# EAGLE schematic Beta24_mix (EAGLE 9.4.2)

## Sheet 1 of 2
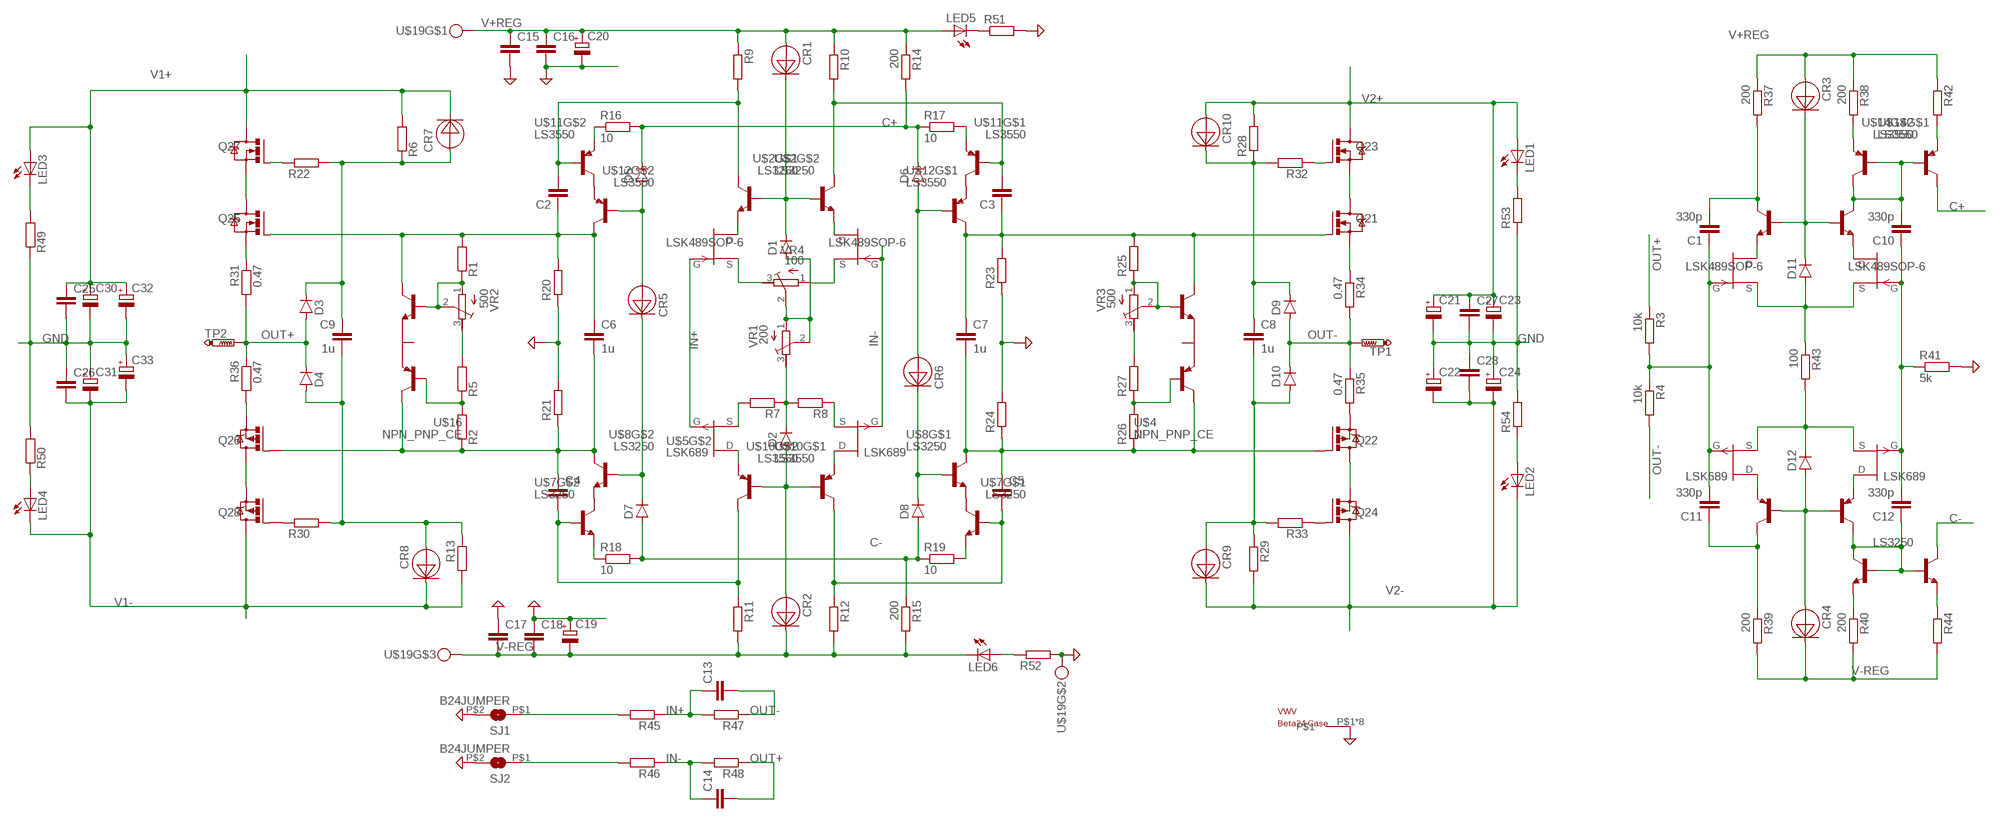
[diagram p0: schematic, sheet 1]

### Parts
C1  330p  C-EUC1206  [C1206]
C2  C-EUC1206  [C1206]
C3  C-EUC1206  [C1206]
C4  C-EUC1206  [C1206]
C5  C-EUC1206  [C1206]
C6  1u  C-EUC1210  [C1210]
C7  1u  C-EUC1210  [C1210]
C8  1u  C-EUC1206  [C1206]
C9  1u  C-EUC1206  [C1206]
C10  330p  C-EUC1206  [C1206]
C11  330p  C-EUC1206  [C1206]
C12  330p  C-EUC1206  [C1206]
C13  C-EUC1206  [C1206]
C14  C-EUC1206  [C1206]
C15  C-EUC1206  [C1206]
C16  C-EUC1206  [C1206]
C17  C-EUC1206  [C1206]
C18  C-EUC1206  [C1206]
C19  CPOL-EUG  [PANASONIC_G]
C20  CPOL-EUG  [PANASONIC_G]
C21  CPOL-EUG  [PANASONIC_G]
C22  CPOL-EUG  [PANASONIC_G]
C23  CPOL-EUG  [PANASONIC_G]
C24  CPOL-EUG  [PANASONIC_G]
C25  C-EUC1206  [C1206]
C26  C-EUC1206  [C1206]
C27  C-EUC1206  [C1206]
C28  C-EUC1206  [C1206]
C30  CPOL-EUG  [PANASONIC_G]
C31  CPOL-EUG  [PANASONIC_G]
C32  CPOL-EUG  [PANASONIC_G]
C33  CPOL-EUG  [PANASONIC_G]
CR1  1N5283  [SMD]
CR2  1N5283  [SMD]
CR3  1N5283  [SMD]
CR4  1N5283  [SMD]
CR5  1N5283  [SMD]
CR6  1N5283  [SMD]
CR7  1N5283  [SMD]
CR8  1N5283  [SMD]
CR9  1N5283  [SMD]
CR10  1N5283  [SMD]
D1  DIODE-SOD80C  [SOD80C]
D2  DIODE-SOD80C  [SOD80C]
D3  DIODE-SOD80C  [SOD80C]
D4  DIODE-SOD80C  [SOD80C]
D5  DIODE-SOD80C  [SOD80C]
D6  DIODE-SOD80C  [SOD80C]
D7  DIODE-SOD80C  [SOD80C]
D8  DIODE-SOD80C  [SOD80C]
D9  DIODE-SOD80C  [SOD80C]
D10  DIODE-SOD80C  [SOD80C]
D11  DIODE-SOD80C  [SOD80C]
D12  DIODE-SOD80C  [SOD80C]
LED1  LED_LEDSML1206  [LED_SML1206]
LED2  LED_LEDSML1206  [LED_SML1206]
LED3  LED_LEDSML1206  [LED_SML1206]
LED4  LED_LEDSML1206  [LED_SML1206]
LED5  LED_LEDSML1206  [LED_SML1206]
LED6  LED_LEDSML1206  [LED_SML1206]
Q21  IRFZ24ND2PAK  [TO254P1054X240-3M]
Q22  IRF9Z34D2PAK  [TO254P1054X240-3M]
Q23  IRFZ24ND2PAK  [TO254P1054X240-3M]
Q24  IRF9Z34D2PAK  [TO254P1054X240-3M]
Q25  IRFZ24ND2PAK  [TO254P1054X240-3M]
Q26  IRF9Z34D2PAK  [TO254P1054X240-3M]
Q27  IRFZ24ND2PAK  [TO254P1054X240-3M]
Q28  IRF9Z34D2PAK  [TO254P1054X240-3M]
R1  R-EU_MELF0204W  [MINI_MELF-0204W]
R2  R-EU_MELF0204W  [MINI_MELF-0204W]
R3  10k  R-EU_MELF0204W  [MINI_MELF-0204W]
R4  10k  R-EU_MELF0204W  [MINI_MELF-0204W]
R5  R-EU_MELF0204W  [MINI_MELF-0204W]
R6  R-EU_MELF0204W  [MINI_MELF-0204W]
R7  R-EU_MELF0204W  [MINI_MELF-0204W]
R8  R-EU_MELF0204W  [MINI_MELF-0204W]
R9  R-EU_MELF0204W  [MINI_MELF-0204W]
R10  R-EU_MELF0204W  [MINI_MELF-0204W]
R11  R-EU_MELF0204W  [MINI_MELF-0204W]
R12  R-EU_MELF0204W  [MINI_MELF-0204W]
R13  R-EU_MELF0204W  [MINI_MELF-0204W]
R14  200  R-EU_MELF0204W  [MINI_MELF-0204W]
R15  200  R-EU_MELF0204W  [MINI_MELF-0204W]
R16  10  R-EU_MELF0204W  [MINI_MELF-0204W]
R17  10  R-EU_MELF0204W  [MINI_MELF-0204W]
R18  10  R-EU_MELF0204W  [MINI_MELF-0204W]
R19  10  R-EU_MELF0204W  [MINI_MELF-0204W]
R20  R-EU_MELF0204W  [MINI_MELF-0204W]
R21  R-EU_MELF0204W  [MINI_MELF-0204W]
R22  R-EU_MELF0204W  [MINI_MELF-0204W]
R23  R-EU_MELF0204W  [MINI_MELF-0204W]
R24  R-EU_MELF0204W  [MINI_MELF-0204W]
R25  R-EU_MELF0204W  [MINI_MELF-0204W]
R26  R-EU_MELF0204W  [MINI_MELF-0204W]
R27  R-EU_MELF0204W  [MINI_MELF-0204W]
R28  R-EU_MELF0204W  [MINI_MELF-0204W]
R29  R-EU_MELF0204W  [MINI_MELF-0204W]
R30  R-EU_MELF0204W  [MINI_MELF-0204W]
R31  0.47  R-EU_R2512  [R2512]
R32  R-EU_MELF0204W  [MINI_MELF-0204W]
R33  R-EU_MELF0204W  [MINI_MELF-0204W]
R34  0.47  R-EU_R2512  [R2512]
R35  0.47  R-EU_R2512  [R2512]
R36  0.47  R-EU_R2512  [R2512]
R37  200  R-EU_MELF0204W  [MINI_MELF-0204W]
R38  200  R-EU_MELF0204W  [MINI_MELF-0204W]
R39  200  R-EU_MELF0204W  [MINI_MELF-0204W]
R40  200  R-EU_MELF0204W  [MINI_MELF-0204W]
R41  5k  R-EU_MELF0204W  [MINI_MELF-0204W]
R42  R-EU_MELF0204W  [MINI_MELF-0204W]
R43  100  R-EU_MELF0204W  [MINI_MELF-0204W]
R44  R-EU_MELF0204W  [MINI_MELF-0204W]
R45  R-EU_MELF0204W  [MINI_MELF-0204W]
R46  R-EU_MELF0204W  [MINI_MELF-0204W]
R47  R-EU_MELF0204W  [MINI_MELF-0204W]
R48  R-EU_MELF0204W  [MINI_MELF-0204W]
R49  R-EU_MELF0204W  [MINI_MELF-0204W]
R50  R-EU_MELF0204W  [MINI_MELF-0204W]
R51  200  R-EU_MELF0204W  [MINI_MELF-0204W]
R52  R-EU_MELF0204W  [MINI_MELF-0204W]
R53  R-EU_MELF0204W  [MINI_MELF-0204W]
R54  R-EU_MELF0204W  [MINI_MELF-0204W]
SJ1  B24JUMPER  [B24J]
SJ2  B24JUMPER  [B24J]
TP1  PTR1PAD1-20  [P1-20]
TP2  PTR1PAD1-20  [P1-20]
U$1  LSK489SOP-6  [SOT-23-6]
U$2  LS3250  [SOT-23-6]
U$3  LSK489SOP-6  [SOT-23-6]
U$4  NPN_PNP_CE  [SOT25]
U$5  LSK689  [SOT-23-6]
U$6  LS3250  [SOT-23-6]
U$7  LS3250  [SOT-23-6]
U$8  LS3250  [SOT-23-6]
U$9  LS3550  [SOT-23-6]
U$10  LS3550  [SOT-23-6]
U$11  LS3550  [SOT-23-6]
U$12  LS3550  [SOT-23-6]
U$13  LS3250  [SOT-23-6]
U$14  LS3550  [SOT-23-6]
U$15  LSK689  [SOT-23-6]
U$16  NPN_PNP_CE  [SOT25]
U$17  VWV  [VWV]
U$18  B24C  [B24C]
U$19  CON-PTSM-3  [CON-PTSM-3]
VR1  200  R-TRIMM3296W  [RTRIM3296W]
VR2  500  R-TRIMM3296W  [RTRIM3296W]
VR3  500  R-TRIMM3296W  [RTRIM3296W]
VR4  100  R-TRIMM3296W  [RTRIM3296W]

### Nets
C+: D5.C D6.C R14.2 R16.2 R17.1 U$14.6(C)
C-: D7.A D8.A R15.1 R18.2 R19.1 U$13.6(C)
GND: C15.2 C16.2 C17.1 C18.1 C19.+ C20.- C21.- C22.+ C23.- C24.+ C25.2 C26.1 C27.2 C28.1 C30.- C31.+ C32.- C33.+ R20.1 R21.2 R23.1 R24.2 R41.2 R49.1 R50.2 R51.2 R52.2 R53.1 R54.2 SJ1.P$2 SJ2.P$2 U$18.P$1 U$18.P$2 U$18.P$3 U$18.P$4 U$18.P$5 U$18.P$6 U$18.P$7 U$18.P$8 U$19.P$4 ; also sheet 2
IN+: C13.1 R45.1 R47.2 U$1.1(G) U$5.4(G)
IN-: C14.1 R46.1 R48.2 U$1.4(G) U$5.1(G)
N$1: C12.1 U$9.6(C) U$13.1(B) U$13.3(B) U$13.4(C)
N$2: U$1.5(D) U$2.2(E)
N$3: U$1.3(S) VR4.3(E)
N$4: R7.2 U$5.6(S)
N$5: U$1.2(D) U$2.5(E)
N$6: U$5.5(D) U$10.2(E)
N$7: U$1.6(S) VR4.1(A)
N$8: D2.C R7.1 R8.2 VR1.3(E)
N$9: R8.1 U$5.3(S)
N$10: U$5.2(D) U$10.5(E)
N$11: D1.A VR1.1(A) VR1.2(S) VR4.2(S)
N$12: CR2.ANODE D2.A U$10.1(B) U$10.3(B)
N$13: C2.2 R9.2 U$2.6(C) U$11.3(B)
N$14: C3.2 R10.2 U$2.4(C) U$11.1(B)
N$15: C3.1 C7.1 Q21.1(G) R23.2 R25.2 U$4.5(C1) U$12.6(C)
N$16: CR1.CATHODE D1.C U$2.1(B) U$2.3(B)
N$17: R40.1 U$13.2(E)
N$18: C5.2 R12.1 U$7.1(B) U$10.6(C)
N$19: C1.1 C11.2 R3.2 R4.1 U$3.1(G) U$15.4(G)
N$20: C8.2 CR9.ANODE D10.A R29.1 R33.2
N$21: D12.C R43.2 U$15.3(S) U$15.6(S)
N$22: D11.A R43.1 U$3.3(S) U$3.6(S)
N$23: U$11.6(C) U$12.5(E)
N$24: C4.2 R11.1 U$7.3(B) U$10.4(C)
N$25: U$11.4(C) U$12.2(E)
N$26: R38.2 U$14.2(E)
N$27: R16.1 U$11.2(E)
N$28: R17.2 U$11.5(E)
N$29: C10.2 U$6.4(C) U$14.1(B) U$14.3(B) U$14.4(C)
N$30: R18.1 U$7.2(E)
N$31: R19.2 U$7.5(E)
N$32: R45.2 SJ1.P$1
N$33: U$3.5(D) U$6.2(E)
N$34: CR4.ANODE D12.A U$9.1(B) U$9.3(B)
N$35: C2.1 C6.1 Q25.1(G) R1.2 R20.2 U$12.4(C) U$16.5(C1)
N$36: C4.1 C6.2 Q26.1(G) R2.1 R21.1 U$8.4(C) U$16.4(C2)
N$37: U$7.6(C) U$8.5(E)
N$38: U$7.4(C) U$8.2(E)
N$39: R25.1 U$4.1(B1) VR3.1(A) VR3.2(S)
N$42: C1.2 R37.2 U$6.6(C)
N$43: CR5.ANODE D5.A U$12.3(B)
N$44: CR6.ANODE D6.A U$12.1(B)
N$45: CR5.CATHODE D7.C U$8.3(B)
N$46: CR6.CATHODE D8.C U$8.1(B)
N$47: R26.2 R27.1 U$4.3(B2)
N$48: R27.2 VR3.3(E)
N$50: C5.1 C7.2 Q22.1(G) R24.1 R26.1 U$4.4(C2) U$8.6(C)
N$51: R2.2 R5.1 U$16.3(B2)
N$53: R44.1 U$13.5(E)
N$54: C8.1 CR10.CATHODE D9.C R28.1 R32.2
N$57: Q21.2(D) Q21.4(D) Q21.P$1(D) Q21.P$2(D) Q21.P$3(D) Q21.P$4(D) Q21.P$5(D) Q21.P$6(D) Q21.P$7(D) Q21.P$8(D) Q21.P$9(D) Q21.P$10(D) Q21.P$11(D) Q21.P$12(D) Q21.P$13(D) Q21.P$14(D) Q21.P$15(D) Q21.P$16(D) Q21.P$17(D) Q21.P$18(D) Q21.P$19(D) Q21.P$20(D) Q21.P$21(D) Q21.P$22(D) Q21.P$23(D) Q21.P$24(D) Q21.P$25(D) Q21.P$26(D) Q21.P$27(D) Q21.P$28(D) Q21.P$29(D) Q21.P$30(D) Q21.P$31(D) Q21.P$32(D) Q21.P$33(D) Q21.P$34(D) Q21.P$35(D) Q21.P$36(D) Q21.P$37(D) Q21.P$38(D) Q21.P$39(D) Q21.P$40(D) Q21.P$41(D) Q21.P$42(D) Q21.P$43(D) Q21.P$44(D) Q21.P$45(D) Q21.P$46(D) Q21.P$47(D) Q21.P$48(D) Q21.P$49(D) Q21.P$50(D) Q21.P$51(D) Q21.P$52(D) Q21.P$53(D) Q21.P$54(D) Q21.P$55(D) Q21.P$56(D) Q21.P$57(D) Q21.P$58(D) Q21.P$59(D) Q21.P$60(D) Q21.P$61(D) Q21.P$62(D) Q21.P$63(D) Q23.3(S)
N$58: Q22.2(D) Q22.4(D) Q22.P$1(D) Q22.P$2(D) Q22.P$3(D) Q22.P$4(D) Q22.P$5(D) Q22.P$6(D) Q22.P$7(D) Q22.P$8(D) Q22.P$9(D) Q22.P$10(D) Q22.P$11(D) Q22.P$12(D) Q22.P$13(D) Q22.P$14(D) Q22.P$15(D) Q22.P$16(D) Q22.P$17(D) Q22.P$18(D) Q22.P$19(D) Q22.P$20(D) Q22.P$21(D) Q22.P$22(D) Q22.P$23(D) Q22.P$24(D) Q22.P$25(D) Q22.P$26(D) Q22.P$27(D) Q22.P$28(D) Q22.P$29(D) Q22.P$30(D) Q22.P$31(D) Q22.P$32(D) Q22.P$33(D) Q22.P$34(D) Q22.P$35(D) Q22.P$36(D) Q22.P$37(D) Q22.P$38(D) Q22.P$39(D) Q22.P$40(D) Q22.P$41(D) Q22.P$42(D) Q22.P$43(D) Q22.P$44(D) Q22.P$45(D) Q22.P$46(D) Q22.P$47(D) Q22.P$48(D) Q22.P$49(D) Q22.P$50(D) Q22.P$51(D) Q22.P$52(D) Q22.P$53(D) Q22.P$54(D) Q22.P$55(D) Q22.P$56(D) Q22.P$57(D) Q22.P$58(D) Q22.P$59(D) Q22.P$60(D) Q22.P$61(D) Q22.P$62(D) Q22.P$63(D) Q24.3(S)
N$59: Q23.1(G) R32.1
N$60: Q24.1(G) R33.1
N$61: C9.1 CR7.ANODE D3.C R6.1 R22.2
N$62: Q21.3(S) R34.1
N$63: Q22.3(S) R35.2
N$64: C9.2 CR8.ANODE D4.A R13.1 R30.2
N$65: Q25.2(D) Q25.4(D) Q25.P$1(D) Q25.P$2(D) Q25.P$3(D) Q25.P$4(D) Q25.P$5(D) Q25.P$6(D) Q25.P$7(D) Q25.P$8(D) Q25.P$9(D) Q25.P$10(D) Q25.P$11(D) Q25.P$12(D) Q25.P$13(D) Q25.P$14(D) Q25.P$15(D) Q25.P$16(D) Q25.P$17(D) Q25.P$18(D) Q25.P$19(D) Q25.P$20(D) Q25.P$21(D) Q25.P$22(D) Q25.P$23(D) Q25.P$24(D) Q25.P$25(D) Q25.P$26(D) Q25.P$27(D) Q25.P$28(D) Q25.P$29(D) Q25.P$30(D) Q25.P$31(D) Q25.P$32(D) Q25.P$33(D) Q25.P$34(D) Q25.P$35(D) Q25.P$36(D) Q25.P$37(D) Q25.P$38(D) Q25.P$39(D) Q25.P$40(D) Q25.P$41(D) Q25.P$42(D) Q25.P$43(D) Q25.P$44(D) Q25.P$45(D) Q25.P$46(D) Q25.P$47(D) Q25.P$48(D) Q25.P$49(D) Q25.P$50(D) Q25.P$51(D) Q25.P$52(D) Q25.P$53(D) Q25.P$54(D) Q25.P$55(D) Q25.P$56(D) Q25.P$57(D) Q25.P$58(D) Q25.P$59(D) Q25.P$60(D) Q25.P$61(D) Q25.P$62(D) Q25.P$63(D) Q27.3(S)
N$66: Q26.2(D) Q26.4(D) Q26.P$1(D) Q26.P$2(D) Q26.P$3(D) Q26.P$4(D) Q26.P$5(D) Q26.P$6(D) Q26.P$7(D) Q26.P$8(D) Q26.P$9(D) Q26.P$10(D) Q26.P$11(D) Q26.P$12(D) Q26.P$13(D) Q26.P$14(D) Q26.P$15(D) Q26.P$16(D) Q26.P$17(D) Q26.P$18(D) Q26.P$19(D) Q26.P$20(D) Q26.P$21(D) Q26.P$22(D) Q26.P$23(D) Q26.P$24(D) Q26.P$25(D) Q26.P$26(D) Q26.P$27(D) Q26.P$28(D) Q26.P$29(D) Q26.P$30(D) Q26.P$31(D) Q26.P$32(D) Q26.P$33(D) Q26.P$34(D) Q26.P$35(D) Q26.P$36(D) Q26.P$37(D) Q26.P$38(D) Q26.P$39(D) Q26.P$40(D) Q26.P$41(D) Q26.P$42(D) Q26.P$43(D) Q26.P$44(D) Q26.P$45(D) Q26.P$46(D) Q26.P$47(D) Q26.P$48(D) Q26.P$49(D) Q26.P$50(D) Q26.P$51(D) Q26.P$52(D) Q26.P$53(D) Q26.P$54(D) Q26.P$55(D) Q26.P$56(D) Q26.P$57(D) Q26.P$58(D) Q26.P$59(D) Q26.P$60(D) Q26.P$61(D) Q26.P$62(D) Q26.P$63(D) Q28.3(S)
N$67: Q27.1(G) R22.1
N$68: Q28.1(G) R30.1
N$69: Q26.3(S) R36.2
N$70: Q25.3(S) R31.1
N$71: R1.1 U$16.1(B1) VR2.1(A) VR2.2(S)
N$72: R5.2 VR2.3(E)
N$73: CR3.CATHODE D11.C U$6.1(B) U$6.3(B)
N$75: U$3.2(D) U$6.5(E)
N$76: C10.1 C12.2 R41.1 U$3.4(G) U$15.1(G)
N$77: U$9.2(E) U$15.5(D)
N$79: U$9.5(E) U$15.2(D)
N$80: C11.1 R39.1 U$9.4(C)
N$81: R42.2 U$14.5(E)
N$82: R46.2 SJ2.P$1
N$89: LED3.C R49.2
N$90: LED4.A R50.1
N$91: LED5.C R51.1
N$92: LED6.A R52.1
N$93: LED2.A R54.1
N$94: LED1.C R53.2
OUT+: C14.2 D3.A D4.C R3.1 R31.2 R36.1 R48.1 TP2.TP
OUT-: C13.2 D9.A D10.C R4.2 R34.2 R35.1 R47.1 TP1.TP
V1+: C25.1 C30.+ C32.+ CR7.CATHODE LED3.A Q27.2(D) Q27.4(D) Q27.P$1(D) Q27.P$2(D) Q27.P$3(D) Q27.P$4(D) Q27.P$5(D) Q27.P$6(D) Q27.P$7(D) Q27.P$8(D) Q27.P$9(D) Q27.P$10(D) Q27.P$11(D) Q27.P$12(D) Q27.P$13(D) Q27.P$14(D) Q27.P$15(D) Q27.P$16(D) Q27.P$17(D) Q27.P$18(D) Q27.P$19(D) Q27.P$20(D) Q27.P$21(D) Q27.P$22(D) Q27.P$23(D) Q27.P$24(D) Q27.P$25(D) Q27.P$26(D) Q27.P$27(D) Q27.P$28(D) Q27.P$29(D) Q27.P$30(D) Q27.P$31(D) Q27.P$32(D) Q27.P$33(D) Q27.P$34(D) Q27.P$35(D) Q27.P$36(D) Q27.P$37(D) Q27.P$38(D) Q27.P$39(D) Q27.P$40(D) Q27.P$41(D) Q27.P$42(D) Q27.P$43(D) Q27.P$44(D) Q27.P$45(D) Q27.P$46(D) Q27.P$47(D) Q27.P$48(D) Q27.P$49(D) Q27.P$50(D) Q27.P$51(D) Q27.P$52(D) Q27.P$53(D) Q27.P$54(D) Q27.P$55(D) Q27.P$56(D) Q27.P$57(D) Q27.P$58(D) Q27.P$59(D) Q27.P$60(D) Q27.P$61(D) Q27.P$62(D) Q27.P$63(D) R6.2 ; also sheet 2
V1-: C26.2 C31.- C33.- CR8.CATHODE LED4.C Q28.2(D) Q28.4(D) Q28.P$1(D) Q28.P$2(D) Q28.P$3(D) Q28.P$4(D) Q28.P$5(D) Q28.P$6(D) Q28.P$7(D) Q28.P$8(D) Q28.P$9(D) Q28.P$10(D) Q28.P$11(D) Q28.P$12(D) Q28.P$13(D) Q28.P$14(D) Q28.P$15(D) Q28.P$16(D) Q28.P$17(D) Q28.P$18(D) Q28.P$19(D) Q28.P$20(D) Q28.P$21(D) Q28.P$22(D) Q28.P$23(D) Q28.P$24(D) Q28.P$25(D) Q28.P$26(D) Q28.P$27(D) Q28.P$28(D) Q28.P$29(D) Q28.P$30(D) Q28.P$31(D) Q28.P$32(D) Q28.P$33(D) Q28.P$34(D) Q28.P$35(D) Q28.P$36(D) Q28.P$37(D) Q28.P$38(D) Q28.P$39(D) Q28.P$40(D) Q28.P$41(D) Q28.P$42(D) Q28.P$43(D) Q28.P$44(D) Q28.P$45(D) Q28.P$46(D) Q28.P$47(D) Q28.P$48(D) Q28.P$49(D) Q28.P$50(D) Q28.P$51(D) Q28.P$52(D) Q28.P$53(D) Q28.P$54(D) Q28.P$55(D) Q28.P$56(D) Q28.P$57(D) Q28.P$58(D) Q28.P$59(D) Q28.P$60(D) Q28.P$61(D) Q28.P$62(D) Q28.P$63(D) R13.2 ; also sheet 2
V2+: C21.+ C23.+ C27.1 CR10.ANODE LED1.A Q23.2(D) Q23.4(D) Q23.P$1(D) Q23.P$2(D) Q23.P$3(D) Q23.P$4(D) Q23.P$5(D) Q23.P$6(D) Q23.P$7(D) Q23.P$8(D) Q23.P$9(D) Q23.P$10(D) Q23.P$11(D) Q23.P$12(D) Q23.P$13(D) Q23.P$14(D) Q23.P$15(D) Q23.P$16(D) Q23.P$17(D) Q23.P$18(D) Q23.P$19(D) Q23.P$20(D) Q23.P$21(D) Q23.P$22(D) Q23.P$23(D) Q23.P$24(D) Q23.P$25(D) Q23.P$26(D) Q23.P$27(D) Q23.P$28(D) Q23.P$29(D) Q23.P$30(D) Q23.P$31(D) Q23.P$32(D) Q23.P$33(D) Q23.P$34(D) Q23.P$35(D) Q23.P$36(D) Q23.P$37(D) Q23.P$38(D) Q23.P$39(D) Q23.P$40(D) Q23.P$41(D) Q23.P$42(D) Q23.P$43(D) Q23.P$44(D) Q23.P$45(D) Q23.P$46(D) Q23.P$47(D) Q23.P$48(D) Q23.P$49(D) Q23.P$50(D) Q23.P$51(D) Q23.P$52(D) Q23.P$53(D) Q23.P$54(D) Q23.P$55(D) Q23.P$56(D) Q23.P$57(D) Q23.P$58(D) Q23.P$59(D) Q23.P$60(D) Q23.P$61(D) Q23.P$62(D) Q23.P$63(D) R28.2 ; also sheet 2
V2-: C22.- C24.- C28.2 CR9.CATHODE LED2.C Q24.2(D) Q24.4(D) Q24.P$1(D) Q24.P$2(D) Q24.P$3(D) Q24.P$4(D) Q24.P$5(D) Q24.P$6(D) Q24.P$7(D) Q24.P$8(D) Q24.P$9(D) Q24.P$10(D) Q24.P$11(D) Q24.P$12(D) Q24.P$13(D) Q24.P$14(D) Q24.P$15(D) Q24.P$16(D) Q24.P$17(D) Q24.P$18(D) Q24.P$19(D) Q24.P$20(D) Q24.P$21(D) Q24.P$22(D) Q24.P$23(D) Q24.P$24(D) Q24.P$25(D) Q24.P$26(D) Q24.P$27(D) Q24.P$28(D) Q24.P$29(D) Q24.P$30(D) Q24.P$31(D) Q24.P$32(D) Q24.P$33(D) Q24.P$34(D) Q24.P$35(D) Q24.P$36(D) Q24.P$37(D) Q24.P$38(D) Q24.P$39(D) Q24.P$40(D) Q24.P$41(D) Q24.P$42(D) Q24.P$43(D) Q24.P$44(D) Q24.P$45(D) Q24.P$46(D) Q24.P$47(D) Q24.P$48(D) Q24.P$49(D) Q24.P$50(D) Q24.P$51(D) Q24.P$52(D) Q24.P$53(D) Q24.P$54(D) Q24.P$55(D) Q24.P$56(D) Q24.P$57(D) Q24.P$58(D) Q24.P$59(D) Q24.P$60(D) Q24.P$61(D) Q24.P$62(D) Q24.P$63(D) R29.2 ; also sheet 2
V+REG: C15.1 C16.1 C20.+ CR1.ANODE CR3.ANODE LED5.A R9.1 R10.1 R14.1 R37.1 R38.1 R42.1 U$19.P$3
V-REG: C17.2 C18.2 C19.- CR2.CATHODE CR4.CATHODE LED6.C R11.2 R12.2 R15.2 R39.2 R40.2 R44.2 U$19.P$5
Unconnected: U$4.2(E) U$16.2(E)

## Sheet 2 of 2
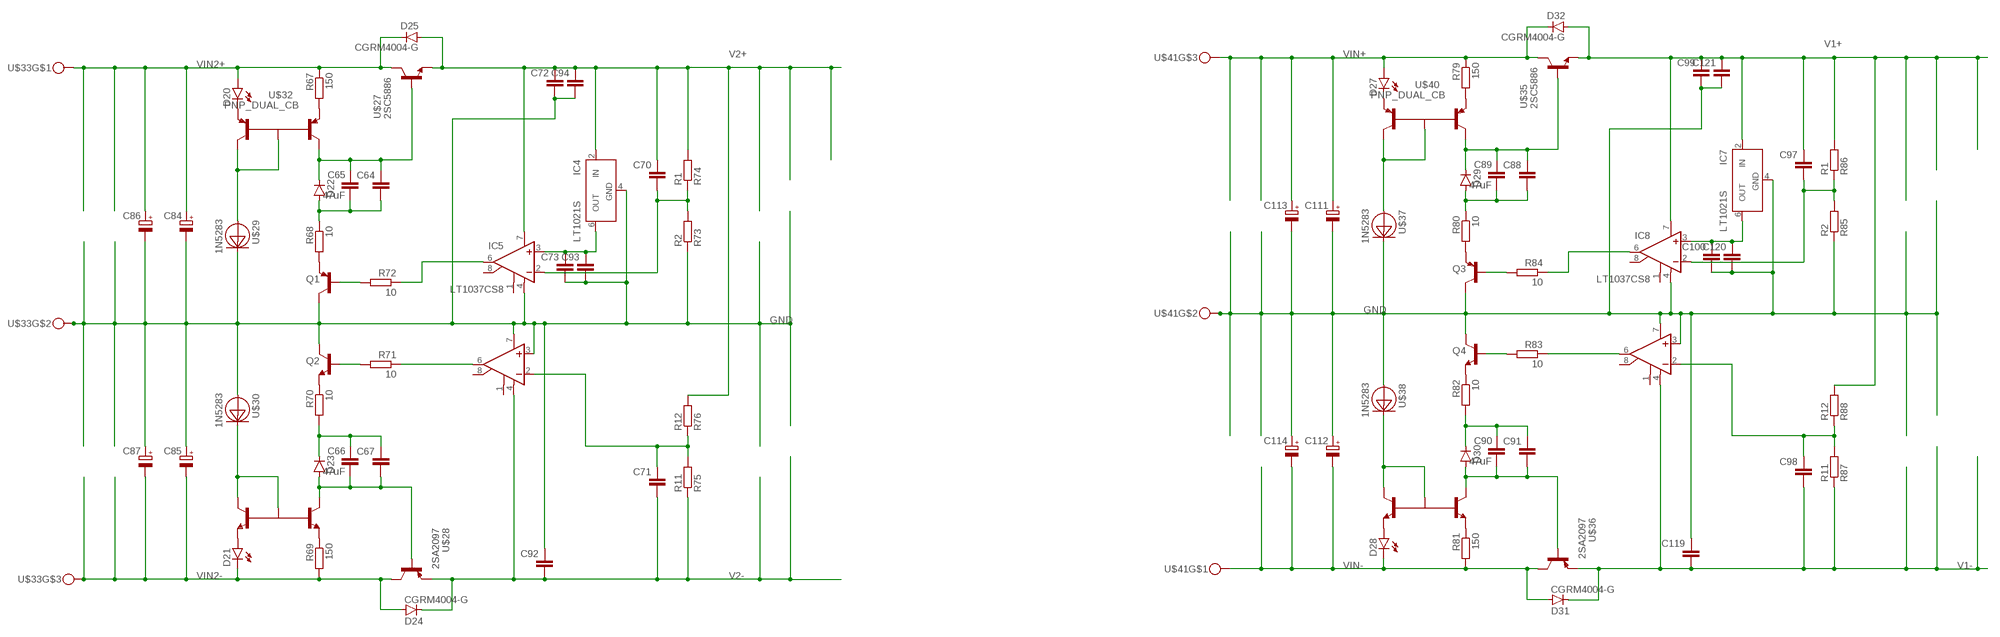
[diagram p1: schematic, sheet 2]

### Parts
C64  C-EUC0805  [C0805]
C65  47uF  C-EUC1206  [C1206]
C66  47uF  C-EUC1206  [C1206]
C67  C-EUC0805  [C0805]
C70  C-EUC0805  [C0805]
C71  C-EUC0805  [C0805]
C72  C-EUC0805  [C0805]
C73  C-EUC0805  [C0805]
C84  CPOL-EUG  [PANASONIC_G]
C85  CPOL-EUG  [PANASONIC_G]
C86  CPOL-EUG  [PANASONIC_G]
C87  CPOL-EUG  [PANASONIC_G]
C88  C-EUC0805  [C0805]
C89  47uF  C-EUC1206  [C1206]
C90  47uF  C-EUC1206  [C1206]
C91  C-EUC0805  [C0805]
C92  C-EUC0805  [C0805]
C93  C-EUC0805  [C0805]
C94  C-EUC0805  [C0805]
C97  C-EUC0805  [C0805]
C98  C-EUC0805  [C0805]
C99  C-EUC0805  [C0805]
C100  C-EUC0805  [C0805]
C111  CPOL-EUG  [PANASONIC_G]
C112  CPOL-EUG  [PANASONIC_G]
C113  CPOL-EUG  [PANASONIC_G]
C114  CPOL-EUG  [PANASONIC_G]
C119  C-EUC0805  [C0805]
C120  C-EUC0805  [C0805]
C121  C-EUC0805  [C0805]
D20  LEDVWV1206  [LED_SML1206]
D21  LEDVWV1206  [LED_SML1206]
D22  TZMC10  DIODE-SOD80C  [SOD80C]
D23  TZAMC10  DIODE-SOD80C  [SOD80C]
D24  CGRM4004-G  [SOD-123_MINI-SMA]
D25  CGRM4004-G  [SOD-123_MINI-SMA]
D27  LEDVWV1206  [LED_SML1206]
D28  LEDVWV1206  [LED_SML1206]
D29  TZMC10  DIODE-SOD80C  [SOD80C]
D30  TZAMC10  DIODE-SOD80C  [SOD80C]
D31  CGRM4004-G  [SOD-123_MINI-SMA]
D32  CGRM4004-G  [SOD-123_MINI-SMA]
IC4  LT1021S  [SOIC8]
IC5  LT1037CS8  [SOIC8]
IC6  LT1037CS8  [SOIC8]
IC7  LT1021S  [SOIC8]
IC8  LT1037CS8  [SOIC8]
IC9  LT1037CS8  [SOIC8]
Q1  TRANSISTOR_BC857C-PNP-SOT23-BEC  [TRANSISTOR_SOT23-BEC]
Q2  TRANSISTOR_BC847CLT1-NPN-SOT23-BEC  [TRANSISTOR_SOT23-BEC]
Q3  TRANSISTOR_BC857C-PNP-SOT23-BEC  [TRANSISTOR_SOT23-BEC]
Q4  TRANSISTOR_BC847CLT1-NPN-SOT23-BEC  [TRANSISTOR_SOT23-BEC]
R67  150  R-EU_MELF0204W  [MINI_MELF-0204W]
R68  10  R-EU_MELF0204W  [MINI_MELF-0204W]
R69  150  R-EU_MELF0204W  [MINI_MELF-0204W]
R70  10  R-EU_MELF0204W  [MINI_MELF-0204W]
R71  10  R-EU_MELF0204W  [MINI_MELF-0204W]
R72  10  R-EU_MELF0204W  [MINI_MELF-0204W]
R73  R2  R-EU_MELF0204W  [MINI_MELF-0204W]
R74  R1  R-EU_MELF0204W  [MINI_MELF-0204W]
R75  R11  R-EU_MELF0204W  [MINI_MELF-0204W]
R76  R12  R-EU_MELF0204W  [MINI_MELF-0204W]
R79  150  R-EU_MELF0204W  [MINI_MELF-0204W]
R80  10  R-EU_MELF0204W  [MINI_MELF-0204W]
R81  150  R-EU_MELF0204W  [MINI_MELF-0204W]
R82  10  R-EU_MELF0204W  [MINI_MELF-0204W]
R83  10  R-EU_MELF0204W  [MINI_MELF-0204W]
R84  10  R-EU_MELF0204W  [MINI_MELF-0204W]
R85  R2  R-EU_MELF0204W  [MINI_MELF-0204W]
R86  R1  R-EU_MELF0204W  [MINI_MELF-0204W]
R87  R11  R-EU_MELF0204W  [MINI_MELF-0204W]
R88  R12  R-EU_MELF0204W  [MINI_MELF-0204W]
U$27  2SC5886  [NEW-PWMOLD]
U$28  2SA2097  [NEW-PWMOLD]
U$29  1N5283  [SMD]
U$30  1N5283  [SMD]
U$31  NPN_DUAL_CBSOT-25-5  [SOT25]
U$32  PNP_DUAL_CB  [SOT25]
U$33  CON-PTSM-3  [CON-PTSM-3]
U$35  2SC5886  [NEW-PWMOLD]
U$36  2SA2097  [NEW-PWMOLD]
U$37  1N5283  [SMD]
U$38  1N5283  [SMD]
U$39  NPN_DUAL_CBSOT-25-5  [SOT25]
U$40  PNP_DUAL_CB  [SOT25]
U$41  CON-PTSM-3  [CON-PTSM-3]

### Nets
GND: C72.2 C73.2 C84.- C85.+ C86.- C87.+ C92.1 C93.2 C94.2 C99.2 C100.2 C111.- C112.+ C113.- C114.+ C119.1 C120.2 C121.2 IC4.4(GND) IC5.4(V-) IC6.3(+IN) IC6.7(V+) IC7.4(GND) IC8.4(V-) IC9.3(+IN) IC9.7(V+) Q1.C Q2.C Q3.C Q4.C R73.1 R85.1 U$29.CATHODE U$30.ANODE U$33.P$4 U$37.CATHODE U$38.ANODE U$41.P$4 ; also sheet 1
N$106: U$29.ANODE U$32.2(B) U$32.5(C1)
N$107: C64.1 C65.1 D22.C U$27.1(B) U$32.4(C2)
N$108: C64.2 C65.2 D22.A R68.1
N$109: Q1.E R68.2
N$110: Q2.E R70.1
N$111: C66.1 C67.1 D23.C R70.2
N$112: C66.2 C67.2 D23.A U$28.1(B) U$31.4(C2)
N$113: U$30.CATHODE U$31.2(B) U$31.5(C1)
N$114: Q2.B R71.2
N$115: Q1.B R72.2
N$116: C70.2 IC5.2(-IN) R73.2 R74.1
N$119: IC6.6(OUT) R71.1
N$120: C71.1 IC6.2(-IN) R75.2 R76.1
N$121: C73.1 C93.1 IC4.6(OUT) IC5.3(+IN)
N$122: IC5.6(OUT) R72.1
N$123: R69.1 U$31.3(E2)
N$124: D21.A U$31.1(E1)
N$125: R67.2 U$32.3(E2)
N$126: D20.C U$32.1(E1)
N$127: U$37.ANODE U$40.2(B) U$40.5(C1)
N$128: C88.1 C89.1 D29.C U$35.1(B) U$40.4(C2)
N$129: C88.2 C89.2 D29.A R80.1
N$130: Q3.E R80.2
N$131: Q4.E R82.1
N$132: C90.1 C91.1 D30.C R82.2
N$133: C90.2 C91.2 D30.A U$36.1(B) U$39.4(C2)
N$134: U$38.CATHODE U$39.2(B) U$39.5(C1)
N$135: Q4.B R83.2
N$136: Q3.B R84.2
N$137: C97.2 IC8.2(-IN) R85.2 R86.1
N$140: IC9.6(OUT) R83.1
N$141: C98.1 IC9.2(-IN) R87.2 R88.1
N$142: C100.1 C120.1 IC7.6(OUT) IC8.3(+IN)
N$143: IC8.6(OUT) R84.1
N$144: R81.1 U$39.3(E2)
N$145: D28.A U$39.1(E1)
N$146: R79.2 U$40.3(E2)
N$147: D27.C U$40.1(E1)
V1+: C97.1 C99.1 C121.1 D32.A IC7.2(IN) IC8.7(V+) R86.2 R88.2 U$35.3(E) ; also sheet 1
V1-: C98.2 C119.2 D31.C IC9.4(V-) R87.1 U$36.3(E) ; also sheet 1
V2+: C70.1 C72.1 C94.1 D25.A IC4.2(IN) IC5.7(V+) R74.2 R76.2 U$27.3(E) ; also sheet 1
V2-: C71.2 C92.2 D24.C IC6.4(V-) R75.1 U$28.3(E) ; also sheet 1
VIN2+: C84.+ C86.+ D20.A D25.C R67.1 U$27.2(C) U$27.4(C) U$27.P$1(C) U$27.P$2(C) U$27.P$3(C) U$27.P$4(C) U$27.P$5(C) U$27.P$6(C) U$27.P$7(C) U$27.P$8(C) U$27.P$9(C) U$27.P$10(C) U$27.P$11(C) U$27.P$12(C) U$27.P$13(C) U$27.P$14(C) U$27.P$15(C) U$27.P$16(C) U$27.P$17(C) U$27.P$18(C) U$27.P$19(C) U$27.P$20(C) U$27.P$21(C) U$27.P$22(C) U$27.P$23(C) U$27.P$24(C) U$27.P$25(C) U$27.P$26(C) U$27.P$27(C) U$27.P$28(C) U$27.P$29(C) U$27.P$30(C) U$27.P$31(C) U$27.P$32(C) U$27.P$33(C) U$27.P$34(C) U$27.P$35(C) U$27.P$36(C) U$27.P$37(C) U$27.P$38(C) U$27.P$39(C) U$27.P$40(C) U$27.P$41(C) U$27.P$42(C) U$27.P$43(C) U$27.P$44(C) U$27.P$45(C) U$27.P$46(C) U$27.P$47(C) U$27.P$48(C) U$27.P$49(C) U$27.P$50(C) U$27.P$51(C) U$27.P$52(C) U$27.P$53(C) U$27.P$54(C) U$27.P$55(C) U$27.P$56(C) U$27.P$57(C) U$27.P$58(C) U$27.P$59(C) U$27.P$60(C) U$27.P$61(C) U$27.P$62(C) U$27.P$63(C) U$33.P$3
VIN2-: C85.- C87.- D21.C D24.A R69.2 U$28.2(C) U$28.4(C) U$28.P$1(C) U$28.P$2(C) U$28.P$3(C) U$28.P$4(C) U$28.P$5(C) U$28.P$6(C) U$28.P$7(C) U$28.P$8(C) U$28.P$9(C) U$28.P$10(C) U$28.P$11(C) U$28.P$12(C) U$28.P$13(C) U$28.P$14(C) U$28.P$15(C) U$28.P$16(C) U$28.P$17(C) U$28.P$18(C) U$28.P$19(C) U$28.P$20(C) U$28.P$21(C) U$28.P$22(C) U$28.P$23(C) U$28.P$24(C) U$28.P$25(C) U$28.P$26(C) U$28.P$27(C) U$28.P$28(C) U$28.P$29(C) U$28.P$30(C) U$28.P$31(C) U$28.P$32(C) U$28.P$33(C) U$28.P$34(C) U$28.P$35(C) U$28.P$36(C) U$28.P$37(C) U$28.P$38(C) U$28.P$39(C) U$28.P$40(C) U$28.P$41(C) U$28.P$42(C) U$28.P$43(C) U$28.P$44(C) U$28.P$45(C) U$28.P$46(C) U$28.P$47(C) U$28.P$48(C) U$28.P$49(C) U$28.P$50(C) U$28.P$51(C) U$28.P$52(C) U$28.P$53(C) U$28.P$54(C) U$28.P$55(C) U$28.P$56(C) U$28.P$57(C) U$28.P$58(C) U$28.P$59(C) U$28.P$60(C) U$28.P$61(C) U$28.P$62(C) U$28.P$63(C) U$33.P$5
VIN+: C111.+ C113.+ D27.A D32.C R79.1 U$35.2(C) U$35.4(C) U$35.P$1(C) U$35.P$2(C) U$35.P$3(C) U$35.P$4(C) U$35.P$5(C) U$35.P$6(C) U$35.P$7(C) U$35.P$8(C) U$35.P$9(C) U$35.P$10(C) U$35.P$11(C) U$35.P$12(C) U$35.P$13(C) U$35.P$14(C) U$35.P$15(C) U$35.P$16(C) U$35.P$17(C) U$35.P$18(C) U$35.P$19(C) U$35.P$20(C) U$35.P$21(C) U$35.P$22(C) U$35.P$23(C) U$35.P$24(C) U$35.P$25(C) U$35.P$26(C) U$35.P$27(C) U$35.P$28(C) U$35.P$29(C) U$35.P$30(C) U$35.P$31(C) U$35.P$32(C) U$35.P$33(C) U$35.P$34(C) U$35.P$35(C) U$35.P$36(C) U$35.P$37(C) U$35.P$38(C) U$35.P$39(C) U$35.P$40(C) U$35.P$41(C) U$35.P$42(C) U$35.P$43(C) U$35.P$44(C) U$35.P$45(C) U$35.P$46(C) U$35.P$47(C) U$35.P$48(C) U$35.P$49(C) U$35.P$50(C) U$35.P$51(C) U$35.P$52(C) U$35.P$53(C) U$35.P$54(C) U$35.P$55(C) U$35.P$56(C) U$35.P$57(C) U$35.P$58(C) U$35.P$59(C) U$35.P$60(C) U$35.P$61(C) U$35.P$62(C) U$35.P$63(C) U$41.P$5
VIN-: C112.- C114.- D28.C D31.A R81.2 U$36.2(C) U$36.4(C) U$36.P$1(C) U$36.P$2(C) U$36.P$3(C) U$36.P$4(C) U$36.P$5(C) U$36.P$6(C) U$36.P$7(C) U$36.P$8(C) U$36.P$9(C) U$36.P$10(C) U$36.P$11(C) U$36.P$12(C) U$36.P$13(C) U$36.P$14(C) U$36.P$15(C) U$36.P$16(C) U$36.P$17(C) U$36.P$18(C) U$36.P$19(C) U$36.P$20(C) U$36.P$21(C) U$36.P$22(C) U$36.P$23(C) U$36.P$24(C) U$36.P$25(C) U$36.P$26(C) U$36.P$27(C) U$36.P$28(C) U$36.P$29(C) U$36.P$30(C) U$36.P$31(C) U$36.P$32(C) U$36.P$33(C) U$36.P$34(C) U$36.P$35(C) U$36.P$36(C) U$36.P$37(C) U$36.P$38(C) U$36.P$39(C) U$36.P$40(C) U$36.P$41(C) U$36.P$42(C) U$36.P$43(C) U$36.P$44(C) U$36.P$45(C) U$36.P$46(C) U$36.P$47(C) U$36.P$48(C) U$36.P$49(C) U$36.P$50(C) U$36.P$51(C) U$36.P$52(C) U$36.P$53(C) U$36.P$54(C) U$36.P$55(C) U$36.P$56(C) U$36.P$57(C) U$36.P$58(C) U$36.P$59(C) U$36.P$60(C) U$36.P$61(C) U$36.P$62(C) U$36.P$63(C) U$41.P$3
Unconnected: IC5.1(CMP1) IC5.8(CMP2) IC6.1(CMP1) IC6.8(CMP2) IC8.1(CMP1) IC8.8(CMP2) IC9.1(CMP1) IC9.8(CMP2)

## Library data of the parts
C1-C18 C25-C28 C64-C67 C70-C73 C88-C94 C97-C100 C119-C121 = Vwvwbg:C-EU: CAPACITOR, European symbol
C19-C24 C30-C33 C84-C87 C111-C114 = Vwvwbg:CPOL-EU: POLARIZED CAPACITOR, European symbol
CR1-CR10 U$29 U$30 U$37 U$38 = crd:1N5283: 0.22 mA through 4.23 mA current regulating diode series
D1-D12 D22 D23 D29 D30 = Vwvwbg:DIODE-: DIODE
D20 D21 D27 D28 = Vwvwbg:LED: LED OSRAM: - CHIPLED LG R971, LG N971, LY N971, LG Q971, LY Q971, LO R971, LY R971 LH N974, LH R974 LS Q976, LO Q976, LY Q976 LO Q996 - Hyper CHIPLED LW Q18S LB Q993, LB Q99A, LB R99A - SideLED LS A670, LO A670, LY A670, LG A670, LP A670 LB A673, LV A673, LT A673, LW A673 LH A674 LY A675 LS A676, LA A676, LO A676, LY A676, LW A676 LS A679, LY A679, LG A679 - Hyper Micro SIDELED® LS Y876, LA Y876, LO Y876, LY Y876 LT Y87S - SmartLED LW L88C, LW L88S LB L89C, LB L89S, LG L890 LS L89K, LO L89K, LY L89K LS L896, LA L896, LO L896, LY L896 - TOPLED LS T670, LO T670, LY T670, LG T670, LP T670 LSG T670, LSP T670, LSY T670, LOP T670, LYG T670 LG T671, LOG T671, LSG T671 LB T673, LV T673, LT T673, LW T673 LH T674 LS T676, LA T676, LO T676, LY T676, LB T676, LH T676, LSB T676, LW T676 LB T67C, LV T67C, LT T67C, LS T67K, LO T67K, LY T67K, LW E67C LS E67B, LA E67B, LO E67B, LY E67B, LB E67C, LV E67C, LT E67C LW T67C LS T679, LY T679, LG T679 LS T770, LO T770, LY T770, LG T770, LP T770 LB T773, LV T773, LT T773, LW T773 LH T774 LS E675, LA E675, LY E675, LS T675 LS T776, LA T776, LO T776, LY T776, LB T776 LHGB T686 LT T68C, LB T68C - Hyper Mini TOPLED® LB M676 - Mini TOPLED Santana® LG M470 LS M47K, LO M47K, LY M47K Source: http://www.osram.convergy.de LUXEON: - LUMILED® LXK2-PW12-R00, LXK2-PW12-S00, LXK2-PW14-U00, LXK2-PW14-V00 LXK2-PM12-R00, LXK2-PM12-S00, LXK2-PM14-U00 LXK2-PE12-Q00, LXK2-PE12-R00, LXK2-PE12-S00, LXK2-PE14-T00, LXK2-PE14-U00 LXK2-PB12-K00, LXK2-PB12-L00, LXK2-PB12-M00, LXK2-PB14-N00, LXK2-PB14-P00, LXK2-PB14-Q00 LXK2-PR12-L00, LXK2-PR12-M00, LXK2-PR14-Q00, LXK2-PR14-R00 LXK2-PD12-Q00, LXK2-PD12-R00, LXK2-PD12-S00 LXK2-PH12-R00, LXK2-PH12-S00 LXK2-PL12-P00, LXK2-PL12-Q00, LXK2-PL12-R00 Source: www.luxeon.com KINGBRIGHT: KA-3528ASYC Source: www.kingbright.com
D24 D25 D31 D32 = diode:CGRM400*-G: Molded plasitc,JEDEC SOD-123/Mini SMA Source: Comchip CGRM4001-G.pdf
IC4 IC7 = Vwvwbg:LT1021: Precision Reference Source: http://www.linear.com/pc/downloadDocument.do?navId=H0,C1,C1010,C1603,P1229,D2805; MPN: LT1021DCS8-10#PBF; OC_FARNELL: 1273428; OC_NEWARK: 57M0993
IC5 IC6 IC8 IC9 = Vwvwbg:LT10*: Low Noise, High Speed, Precision Operational Amplifiers Source: http://www.linear.com/pc/downloadDocument.do?navId=H0,C1,C1154,C1009,C1026,P1212,D2204
LED1-LED6 = KGGR_M:LED_LED: LED OSRAM: - CHIPLED LG R971, LG N971, LY N971, LG Q971, LY Q971, LO R971, LY R971 LH N974, LH R974 LS Q976, LO Q976, LY Q976 LO Q996 - Hyper CHIPLED LW Q18S LB Q993, LB Q99A, LB R99A - SideLED LS A670, LO A670, LY A670, LG A670, LP A670 LB A673, LV A673, LT A673, LW A673 LH A674 LY A675 LS A676, LA A676, LO A676, LY A676, LW A676 LS A679, LY A679, LG A679 - Hyper Micro SIDELED® LS Y876, LA Y876, LO Y876, LY Y876 LT Y87S - SmartLED LW L88C, LW L88S LB L89C, LB L89S, LG L890 LS L89K, LO L89K, LY L89K LS L896, LA L896, LO L896, LY L896 - TOPLED LS T670, LO T670, LY T670, LG T670, LP T670 LSG T670, LSP T670, LSY T670, LOP T670, LYG T670 LG T671, LOG T671, LSG T671 LB T673, LV T673, LT T673, LW T673 LH T674 LS T676, LA T676, LO T676, LY T676, LB T676, LH T676, LSB T676, LW T676 LB T67C, LV T67C, LT T67C, LS T67K, LO T67K, LY T67K, LW E67C LS E67B, LA E67B, LO E67B, LY E67B, LB E67C, LV E67C, LT E67C LW T67C LS T679, LY T679, LG T679 LS T770, LO T770, LY T770, LG T770, LP T770 LB T773, LV T773, LT T773, LW T773 LH T774 LS E675, LA E675, LY E675, LS T675 LS T776, LA T776, LO T776, LY T776, LB T776 LHGB T686 LT T68C, LB T68C - Hyper Mini TOPLED® LB M676 - Mini TOPLED Santana® LG M470 LS M47K, LO M47K, LY M47K Source: http://www.osram.convergy.de LUXEON: - LUMILED® LXK2-PW12-R00, LXK2-PW12-S00, LXK2-PW14-U00, LXK2-PW14-V00 LXK2-PM12-R00, LXK2-PM12-S00, LXK2-PM14-U00 LXK2-PE12-Q00, LXK2-PE12-R00, LXK2-PE12-S00, LXK2-PE14-T00, LXK2-PE14-U00 LXK2-PB12-K00, LXK2-PB12-L00, LXK2-PB12-M00, LXK2-PB14-N00, LXK2-PB14-P00, LXK2-PB14-Q00 LXK2-PR12-L00, LXK2-PR12-M00, LXK2-PR14-Q00, LXK2-PR14-R00 LXK2-PD12-Q00, LXK2-PD12-R00, LXK2-PD12-S00 LXK2-PH12-R00, LXK2-PH12-S00 LXK2-PL12-P00, LXK2-PL12-Q00, LXK2-PL12-R00 Source: www.luxeon.com KINGBRIGHT: KA-3528ASYC Source: www.kingbright.com
Q1 Q3 = Vwvwbg:TRANSISTOR_*-PNP-: PNP Transistror
Q2 Q4 = Vwvwbg:TRANSISTOR_*-NPN-: NPN Transistror BF959 corrected 2008.03.06
Q21 Q23 Q25 Q27 = Vwvwbg:IRFZ24N
Q22 Q24 Q26 Q28 = Vwvwbg:IRF9Z34
R1-R54 R67-R76 R79-R88 = Vwvwbg:R-EU_: RESISTOR, European symbol
SJ1 SJ2 = Vwvwbg:B24JUMPER
TP1 TP2 = testpad:PTR1: TEST PIN
U$1 U$3 = Vwvwbg:LSK489
U$2 U$6-U$8 U$13 = Vwvwbg:LS3250
U$4 U$16 = Vwvwbg:NPN_PNP_CE
U$5 U$15 = Vwvwbg:LSK689
U$9-U$12 U$14 = Vwvwbg:LS3550
U$17 = Vwvwbg:VWV
U$18 = Vwvwbg:B24C
U$19 U$33 U$41 = Vwvwbg:CON-PTSM-3
U$27 U$35 = Vwvwbg:2SC5886
U$28 U$36 = Vwvwbg:2SA2097
U$31 U$39 = Vwvwbg:NPN_DUAL_CB
U$32 U$40 = Vwvwbg:PNP_DUAL_CB
VR1-VR4 = Vwvwbg:R-TRIMM: Trimm resistor; SPICEMODEL: X; SPICEPREFIXL: POT